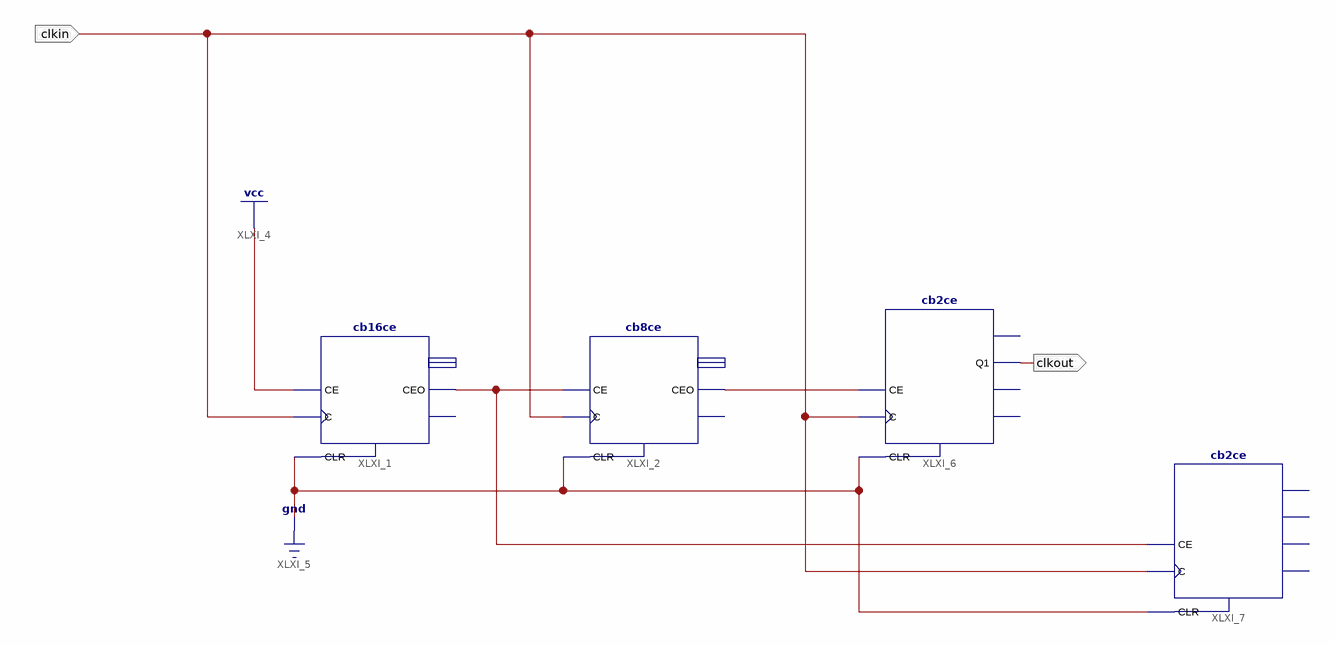
[diagram p0: schematic sheet 1]
// Xilinx ISE schematic CLK_26x.sch (spartan6) as structural Verilog: 4 symbols, 2 ports
module CLK_26x (
  input  clkin,
  output clkout
);

  wire XLXN_14, XLXN_17;

  cb16ce XLXI_1 (.C(clkin), .CE(1'b1), .CLR(1'b0), .CEO(XLXN_17));  // open: Q, TC
  cb8ce XLXI_2 (.C(clkin), .CE(XLXN_17), .CLR(1'b0), .CEO(XLXN_14));  // open: Q, TC
  cb2ce XLXI_6 (.C(clkin), .CE(XLXN_14), .CLR(1'b0), .Q1(clkout));  // open: CEO, Q0, TC
  cb2ce XLXI_7 (.C(clkin), .CE(XLXN_17), .CLR(1'b0));  // open: CEO, Q0, Q1, TC
endmodule
